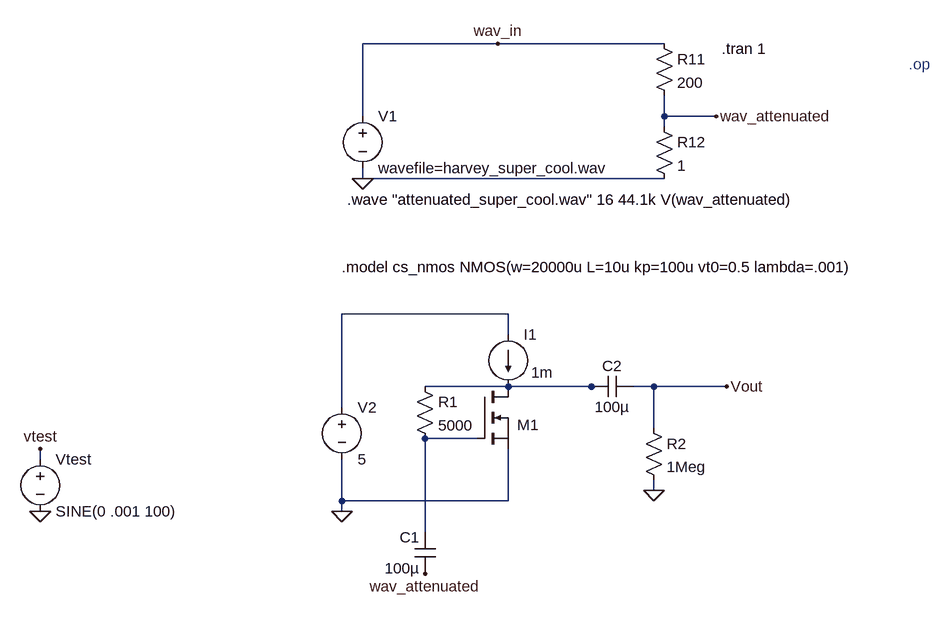
[diagram p0: schematic part_2_e.asc]
part_2_e.asc, the LTspice schematic file:
Version 4
SHEET 1 1372 1164
WIRE 400 -48 192 -48
WIRE 656 -48 400 -48
WIRE 192 64 192 -48
WIRE 656 64 656 32
WIRE 736 64 656 64
WIRE 656 80 656 64
WIRE 192 160 192 144
WIRE 656 160 192 160
WIRE 416 368 160 368
WIRE 416 400 416 368
WIRE 416 480 288 480
WIRE 544 480 416 480
WIRE 560 480 544 480
WIRE 640 480 608 480
WIRE 752 480 640 480
WIRE 160 512 160 368
WIRE 640 544 640 480
WIRE 368 560 288 560
WIRE -304 592 -304 576
WIRE 640 640 640 624
WIRE 160 656 160 592
WIRE 416 656 416 576
WIRE 416 656 160 656
WIRE 160 672 160 656
WIRE 288 704 288 560
FLAG 400 -48 wav_in
FLAG 736 64 wav_attenuated
FLAG 192 160 0
FLAG 160 672 0
FLAG 752 480 Vout
FLAG 640 640 0
FLAG 288 768 wav_attenuated
FLAG -304 672 0
FLAG -304 576 vtest
SYMBOL voltage 192 48 R0
SYMATTR InstName V1
SYMATTR Value wavefile=harvey_super_cool.wav
SYMBOL res 640 -64 R0
SYMATTR InstName R11
SYMATTR Value 200
SYMBOL res 640 64 R0
SYMATTR InstName R12
SYMATTR Value 1
SYMBOL nmos 368 480 R0
WINDOW 0 62 59 Left 2
SYMATTR InstName M1
SYMATTR Value ""
SYMATTR SpiceModel cs_nmos
SYMBOL voltage 160 496 R0
WINDOW 123 0 0 Left 0
WINDOW 39 0 0 Left 0
SYMATTR InstName V2
SYMATTR Value 5
SYMBOL cap 608 464 R90
WINDOW 0 0 32 VBottom 2
WINDOW 3 32 32 VTop 2
SYMATTR InstName C2
SYMATTR Value 100µ
SYMBOL res 624 528 R0
SYMATTR InstName R2
SYMATTR Value 1Meg
SYMBOL current 416 400 R0
WINDOW 3 35 58 Left 2
SYMATTR InstName I1
SYMATTR Value 1m
SYMBOL cap 304 768 R180
WINDOW 0 24 56 Left 2
WINDOW 3 24 8 Left 2
SYMATTR InstName C1
SYMATTR Value 100µ
SYMBOL voltage -304 576 R0
WINDOW 123 0 0 Left 0
WINDOW 39 0 0 Left 0
SYMATTR InstName Vtest
SYMATTR Value SINE(0 .001 100)
SYMBOL res 272 464 R0
SYMATTR InstName R1
SYMATTR Value 5000
TEXT 168 192 Left 2 !.wave "attenuated_super_cool.wav" 16 44.1k V(wav_attenuated)
TEXT 744 -40 Left 2 !.tran 1
TEXT 1032 -16 Left 2 ;.op
TEXT 160 296 Left 2 !.model cs_nmos NMOS(w=20000u L=10u kp=100u vt0=0.5 lambda=.001)

The netlist it stands for:
* part_2_e.asc
V1 wav_in 0 wavefile=harvey_super_cool.wav
R11 wav_in wav_attenuated 200
R12 wav_attenuated 0 1
M1 N002 N003 0 0 cs_nmos
V2 N001 0 5
C2 Vout N002 100µ
R2 Vout 0 1Meg
I1 N001 N002 1m
C1 wav_attenuated N003 100µ
Vtest vtest 0 SINE(0 .001 100)
R1 N002 N003 5000
.model NMOS NMOS
.model PMOS PMOS
.lib standard.mos
.wave "attenuated_super_cool.wav" 16 44.1k V(wav_attenuated)
.tran 1
* .op
.model cs_nmos NMOS(w=20000u L=10u kp=100u vt0=0.5 lambda=.001)
.backanno
.end